# Altium schematic sheet LpGBT-Clocks.SchDoc: Clocks
size A; DocumentNumber: 12; SheetNumber: 12; SheetTotal: 22
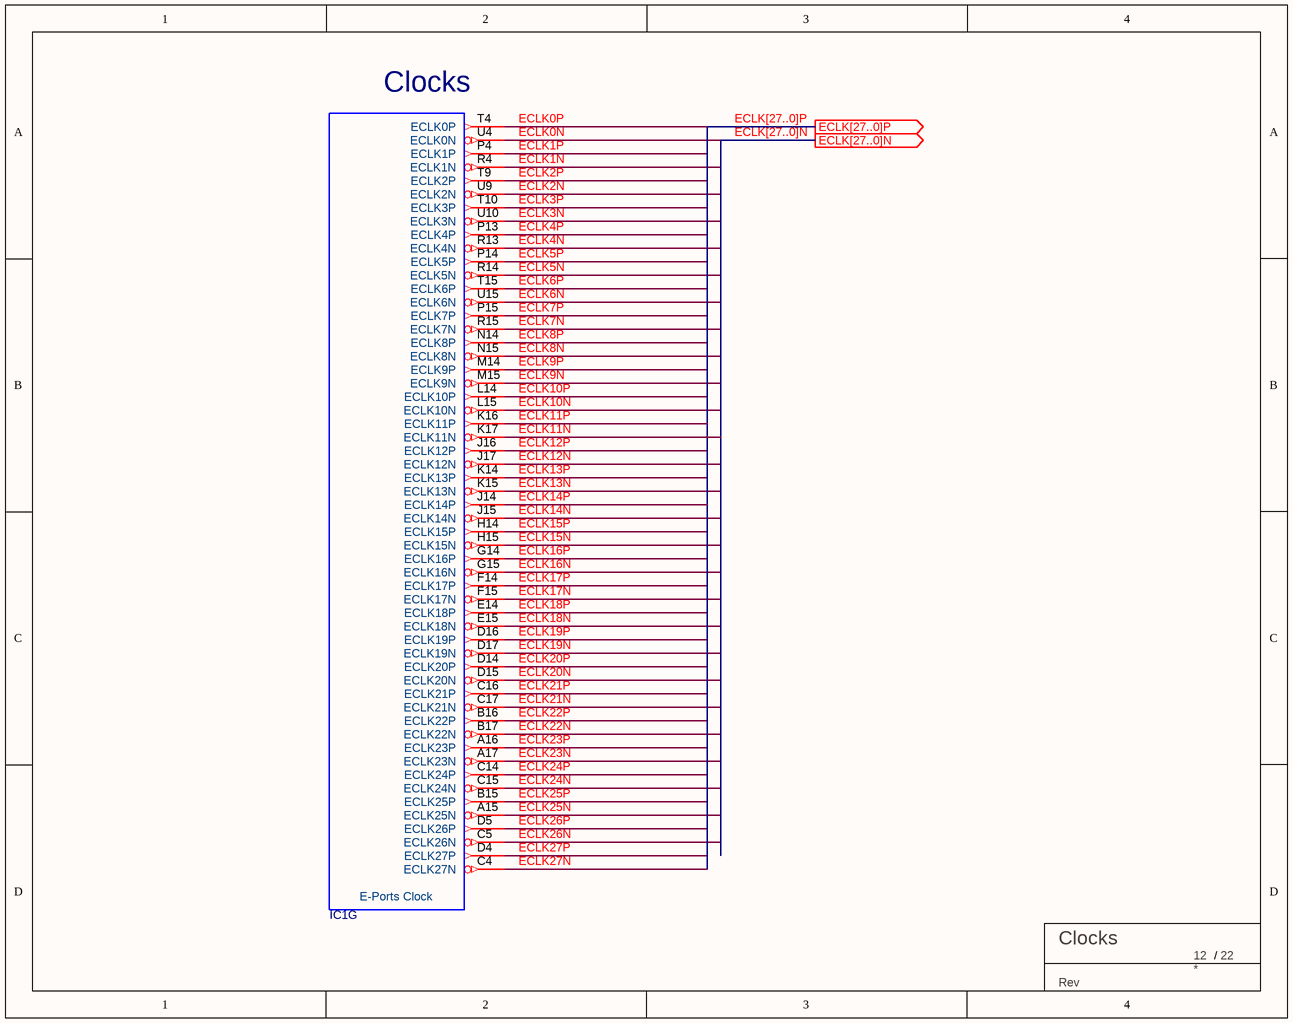
[diagram p0: LpGBT-Clocks.SchDoc]

## Parts
IC1  LPGBT  [BGA289X17]  (value not drawn)  (part G of 8)
TBLOCK?  BU Title block  (value not drawn)  (graphical)

## Ports
ECLK[27..0]N (out), ECLK[27..0]P (out)

## Nets
ECLK0N: IC1.U4(ECLK0N)
ECLK0P: IC1.T4(ECLK0P)
ECLK1N: IC1.R4(ECLK1N)
ECLK1P: IC1.P4(ECLK1P)
ECLK2N: IC1.U9(ECLK2N)
ECLK2P: IC1.T9(ECLK2P)
ECLK3N: IC1.U10(ECLK3N)
ECLK3P: IC1.T10(ECLK3P)
ECLK4N: IC1.R13(ECLK4N)
ECLK4P: IC1.P13(ECLK4P)
ECLK5N: IC1.R14(ECLK5N)
ECLK5P: IC1.P14(ECLK5P)
ECLK6N: IC1.U15(ECLK6N)
ECLK6P: IC1.T15(ECLK6P)
ECLK7N: IC1.R15(ECLK7N)
ECLK7P: IC1.P15(ECLK7P)
ECLK8N: IC1.N15(ECLK8N)
ECLK8P: IC1.N14(ECLK8P)
ECLK9N: IC1.M15(ECLK9N)
ECLK9P: IC1.M14(ECLK9P)
ECLK10N: IC1.L15(ECLK10N)
ECLK10P: IC1.L14(ECLK10P)
ECLK11N: IC1.K17(ECLK11N)
ECLK11P: IC1.K16(ECLK11P)
ECLK12N: IC1.J17(ECLK12N)
ECLK12P: IC1.J16(ECLK12P)
ECLK13N: IC1.K15(ECLK13N)
ECLK13P: IC1.K14(ECLK13P)
ECLK14N: IC1.J15(ECLK14N)
ECLK14P: IC1.J14(ECLK14P)
ECLK15N: IC1.H15(ECLK15N)
ECLK15P: IC1.H14(ECLK15P)
ECLK16N: IC1.G15(ECLK16N)
ECLK16P: IC1.G14(ECLK16P)
ECLK17N: IC1.F15(ECLK17N)
ECLK17P: IC1.F14(ECLK17P)
ECLK18N: IC1.E15(ECLK18N)
ECLK18P: IC1.E14(ECLK18P)
ECLK19N: IC1.D17(ECLK19N)
ECLK19P: IC1.D16(ECLK19P)
ECLK20N: IC1.D15(ECLK20N)
ECLK20P: IC1.D14(ECLK20P)
ECLK21N: IC1.C17(ECLK21N)
ECLK21P: IC1.C16(ECLK21P)
ECLK22N: IC1.B17(ECLK22N)
ECLK22P: IC1.B16(ECLK22P)
ECLK23N: IC1.A17(ECLK23N)
ECLK23P: IC1.A16(ECLK23P)
ECLK24N: IC1.C15(ECLK24N)
ECLK24P: IC1.C14(ECLK24P)
ECLK25N: IC1.A15(ECLK25N)
ECLK25P: IC1.B15(ECLK25P)
ECLK26N: IC1.C5(ECLK26N)
ECLK26P: IC1.D5(ECLK26P)
ECLK27N: IC1.C4(ECLK27N)
ECLK27P: IC1.D4(ECLK27P)

## Buses and harness runs
bus ECLK[27..0]N = port ECLK[27..0]N
bus ECLK[27..0]P = port ECLK[27..0]P

## Notes on the sheet
- (near IC1) Clocks
- (in symbol LPGBT, part G) E-Ports Clock
- (in symbol TITLE_BLOCK_BU) /; Rev

## Library data of the parts
IC1 = LPGBT: Low Power Gigabit Transceiver; Manufacturer: CERN; Pinout Version: 180226; Bonding: No; Device: LPGBT; Manufacturer Part Number: LPGBT; SMD: Yes; Mounted: Yes; LatestRevisionDate: 26.10.2018; PackageDescription: BGA, 289-Leads, Body 9.00x9.00mmx1.28mm, Pitch 0.50mm; Part Description: Low Power Gigabit Transceiver; Case: BGA289; Part Number: LPGBT; Pin Count: 289; Socket: No; Component Kind: Standard; Component Type: Standard; Footprint: BGA289C50P17X17_900X900X128
TBLOCK? = TITLE_BLOCK_BU